# EAGLE schematic M-Controller (EAGLE 7.6.0)
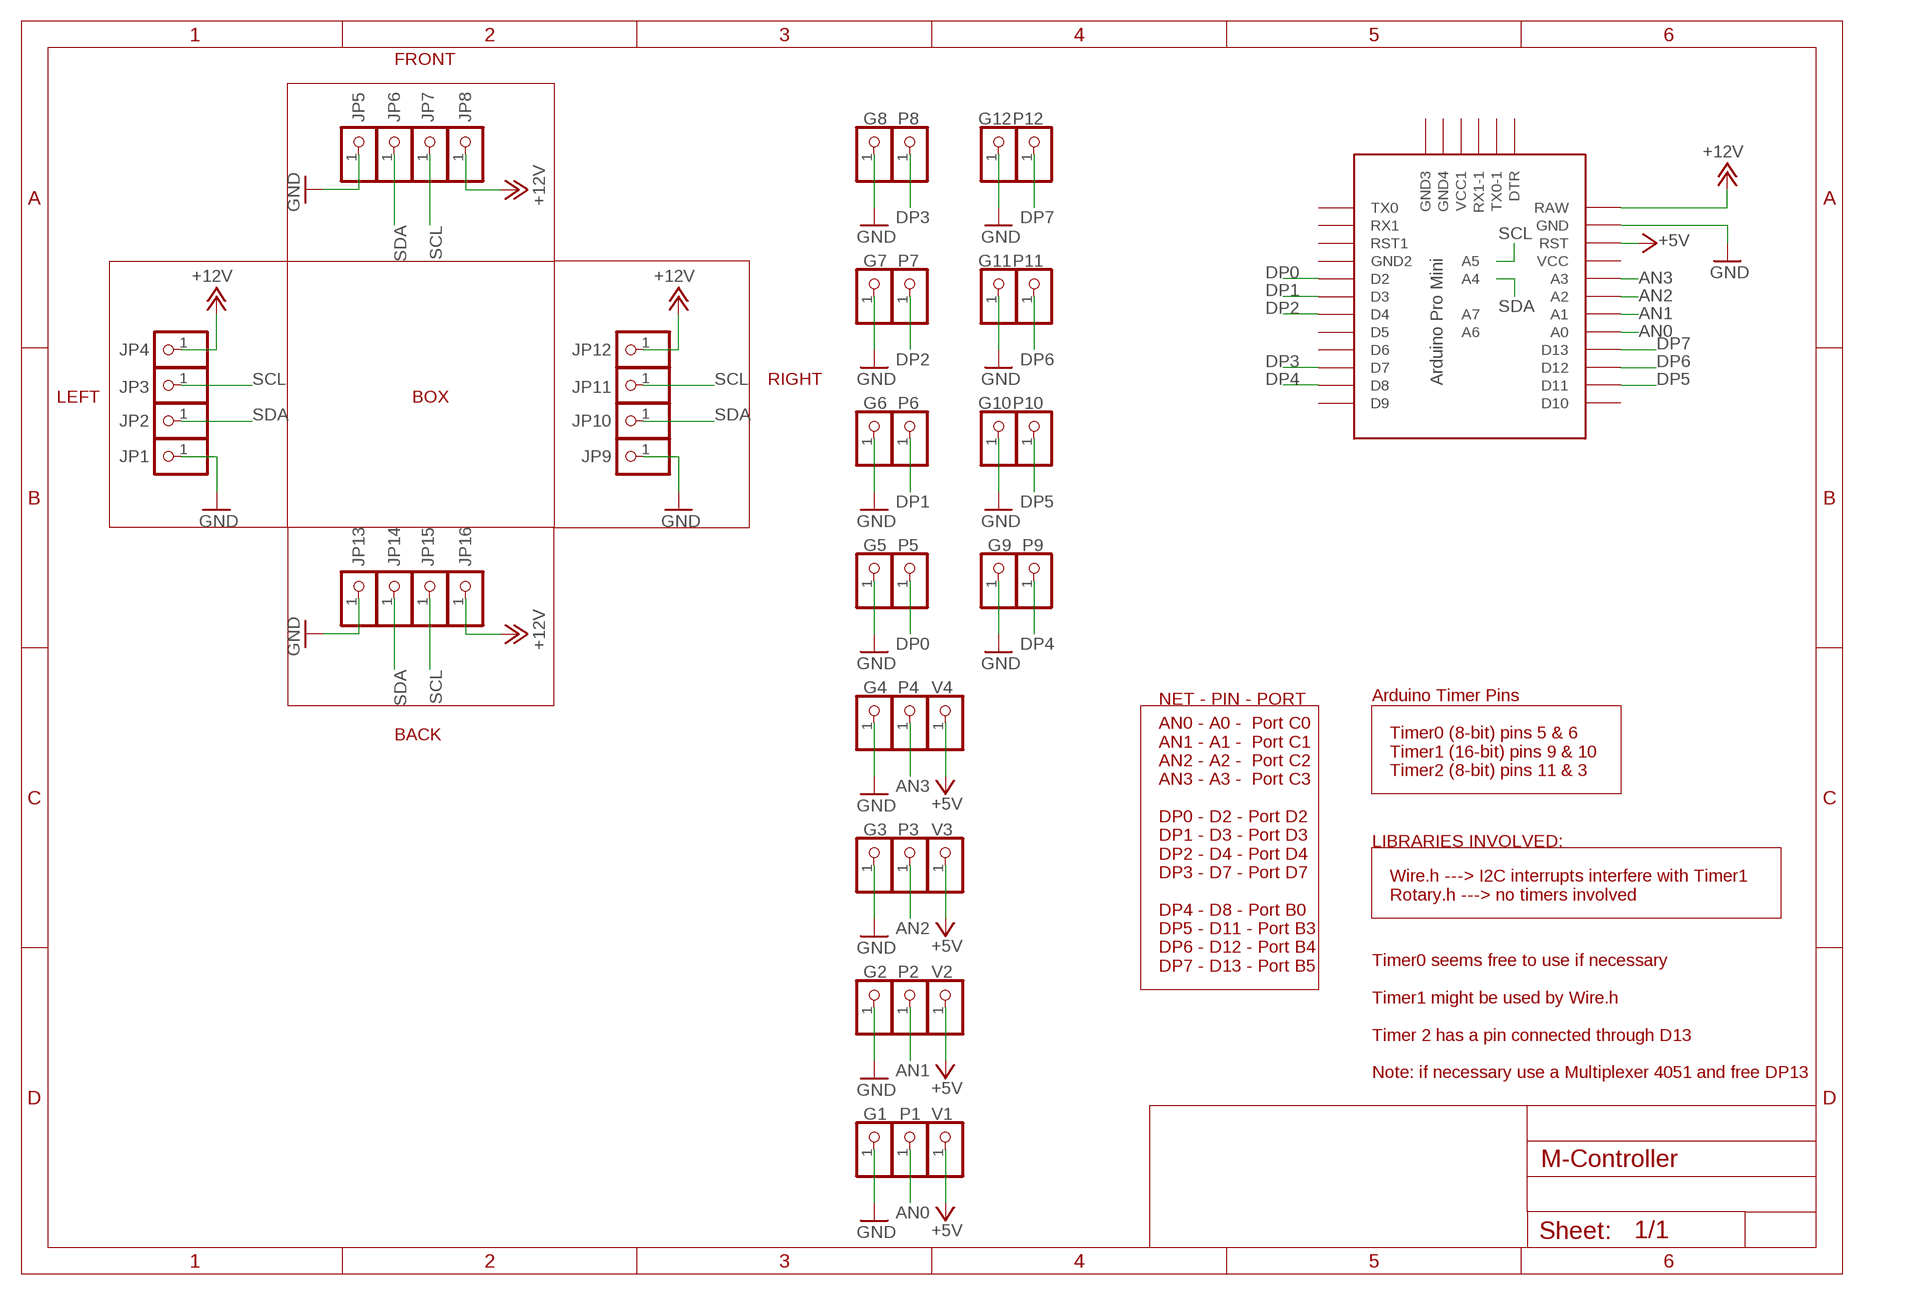
[diagram p0: schematic, sheet 1]

## Parts
G1  PINHD-1X1  [1X01]
G2  PINHD-1X1  [1X01]
G3  PINHD-1X1  [1X01]
G4  PINHD-1X1  [1X01]
G5  PINHD-1X1  [1X01]
G6  PINHD-1X1  [1X01]
G7  PINHD-1X1  [1X01]
G8  PINHD-1X1  [1X01]
G9  PINHD-1X1  [1X01]
G10  PINHD-1X1  [1X01]
G11  PINHD-1X1  [1X01]
G12  PINHD-1X1  [1X01]
JP1  PINHD-1X1  [1X01]
JP2  PINHD-1X1  [1X01]
JP3  PINHD-1X1  [1X01]
JP4  PINHD-1X1  [1X01]
JP5  PINHD-1X1  [1X01]
JP6  PINHD-1X1  [1X01]
JP7  PINHD-1X1  [1X01]
JP8  PINHD-1X1  [1X01]
JP9  PINHD-1X1  [1X01]
JP10  PINHD-1X1  [1X01]
JP11  PINHD-1X1  [1X01]
JP12  PINHD-1X1  [1X01]
JP13  PINHD-1X1  [1X01]
JP14  PINHD-1X1  [1X01]
JP15  PINHD-1X1  [1X01]
JP16  PINHD-1X1  [1X01]
P1  PINHD-1X1  [1X01]
P2  PINHD-1X1  [1X01]
P3  PINHD-1X1  [1X01]
P4  PINHD-1X1  [1X01]
P5  PINHD-1X1  [1X01]
P6  PINHD-1X1  [1X01]
P7  PINHD-1X1  [1X01]
P8  PINHD-1X1  [1X01]
P9  PINHD-1X1  [1X01]
P10  PINHD-1X1  [1X01]
P11  PINHD-1X1  [1X01]
P12  PINHD-1X1  [1X01]
U$1  PRO-MINI-2  [PRO-MINI-2]
V1  PINHD-1X1  [1X01]
V2  PINHD-1X1  [1X01]
V3  PINHD-1X1  [1X01]
V4  PINHD-1X1  [1X01]

## Nets
+5V: U$1.RST V1.1 V2.1 V3.1 V4.1
+12V: JP4.1 JP8.1 JP12.1 JP16.1 U$1.RAW
AN0: P1.1 U$1.A0
AN1: P2.1 U$1.A1
AN2: P3.1 U$1.A2
AN3: P4.1 U$1.A3
DP0: P5.1 U$1.D2
DP1: P6.1 U$1.D3
DP2: P7.1 U$1.D4
DP3: P8.1 U$1.D7
DP4: P9.1 U$1.D8
DP5: P10.1 U$1.D11
DP6: P11.1 U$1.D12
DP7: P12.1 U$1.D13
GND: G1.1 G2.1 G3.1 G4.1 G5.1 G6.1 G7.1 G8.1 G9.1 G10.1 G11.1 G12.1 JP1.1 JP5.1 JP9.1 JP13.1 U$1.GND
SCL: JP3.1 JP7.1 JP11.1 JP15.1 U$1.A5
SDA: JP2.1 JP6.1 JP10.1 JP14.1 U$1.A4
Unconnected: U$1.A6 U$1.A7 U$1.D5 U$1.D6 U$1.D9 U$1.D10 U$1.DTR U$1.GND1(GND2) U$1.GND2(GND3) U$1.GND3(GND4) U$1.RST1 U$1.RX1 U$1.RX1-1 U$1.TX0 U$1.TX0-1 U$1.VCC U$1.VCC1

## Notes on the sheet
- FRONT
- RIGHT
- LEFT | BOX
- NET - PIN - PORT | Arduino Timer Pins
- BACK
- Timer0 (8-bit) pins 5 & 6
  Timer1 (16-bit) pins 9 & 10 
  Timer2 (8-bit) pins 11 & 3
- LIBRARIES INVOLVED:
- Wire.h ---> I2C interrupts interfere with Timer1
  Rotary.h ---> no timers involved
- AN0 - A0 -  Port C0
  AN1 - A1 -  Port C1
  AN2 - A2 -  Port C2
  AN3 - A3 -  Port C3 
  
  DP0 - D2 - Port D2
  DP1 - D3 - Port D3
  DP2 - D4 - Port D4
  DP3 - D7 - Port D7
  
  DP4 - D8 - Port B0
  DP5 - D11 - Port B3
  DP6 - D12 - Port B4
  DP7 - D13 - Port B5
- Timer0 seems free to use if necessary 
  
  Timer1 might be used by Wire.h
  
  Timer 2 has a pin connected through D13
  
  Note: if necessary use a Multiplexer 4051 and free DP13

## Library data of the parts
G1-G12 JP1-JP16 P1-P12 V1-V4 = adafruit:PINHD-1X1: Pin header 1x1 for 0.1" spacing With round pins
U$1 = Arduino-clone:PRO-MINI-2: Arduino Pro Mini Layout 2 Sparkfun.com